# EAGLE design midi-switcher-smt-relay (EAGLE 6.6.0)
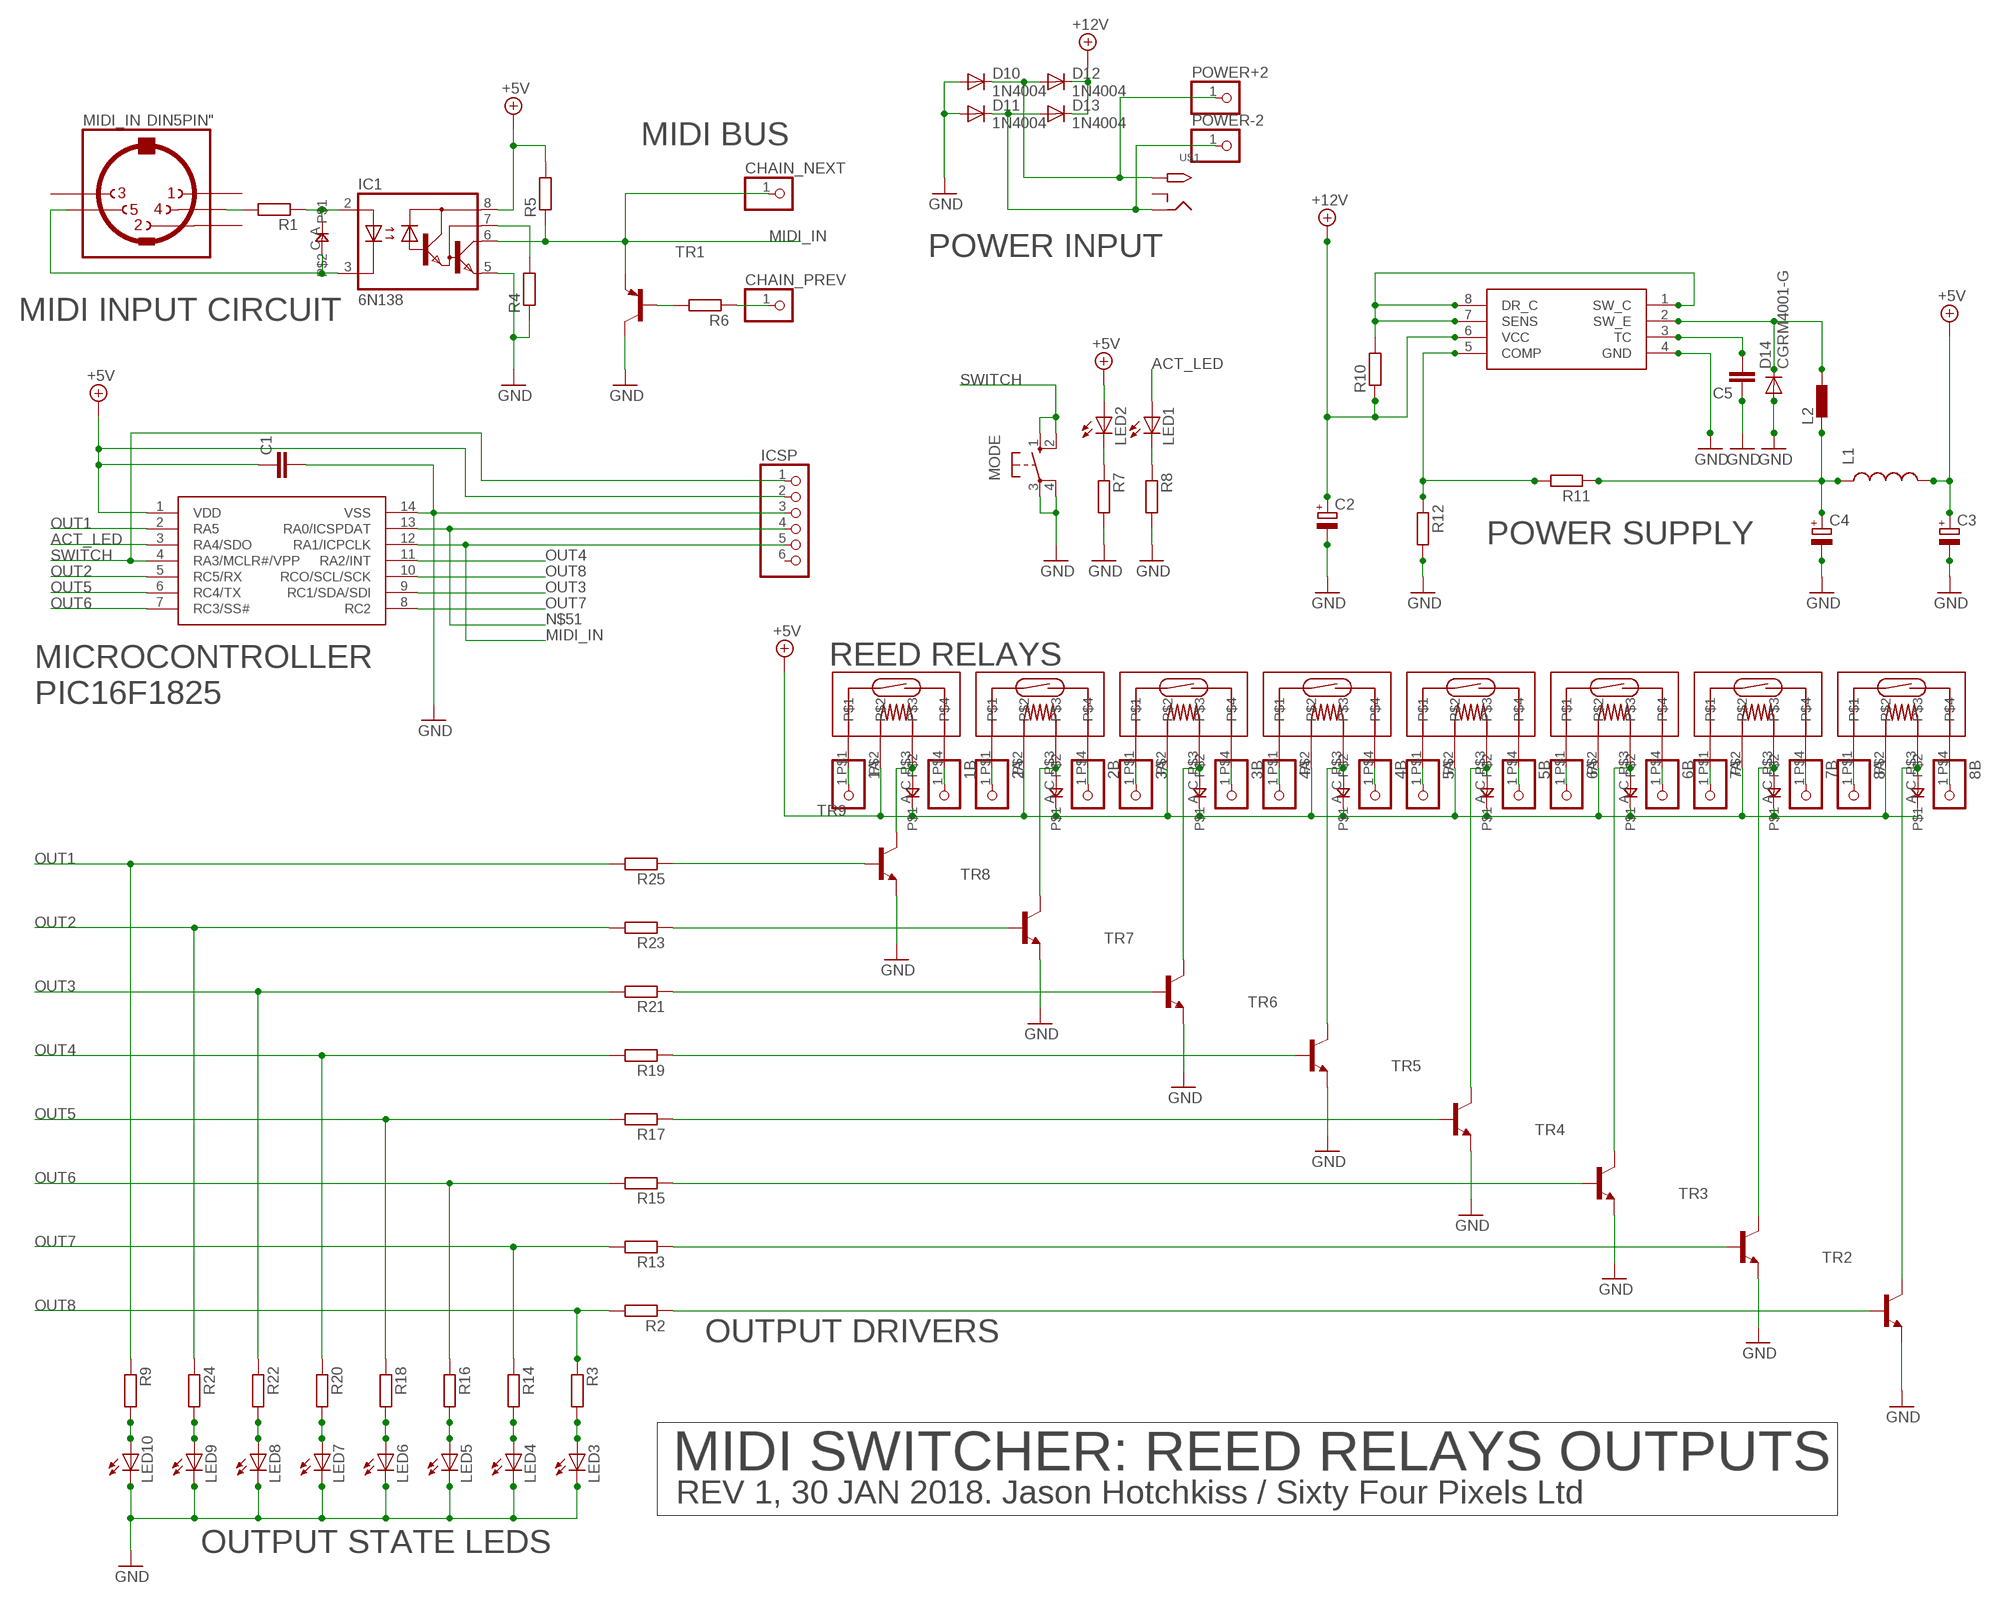
[diagram p0: schematic, sheet 1]

## Parts
1A  PINHD-1X1  [1X01]
1B  PINHD-1X1  [1X01]
2A  PINHD-1X1  [1X01]
2B  PINHD-1X1  [1X01]
3A  PINHD-1X1  [1X01]
3B  PINHD-1X1  [1X01]
4A  PINHD-1X1  [1X01]
4B  PINHD-1X1  [1X01]
5A  PINHD-1X1  [1X01]
5B  PINHD-1X1  [1X01]
6A  PINHD-1X1  [1X01]
6B  PINHD-1X1  [1X01]
7A  PINHD-1X1  [1X01]
7B  PINHD-1X1  [1X01]
8A  PINHD-1X1  [1X01]
8B  PINHD-1X1  [1X01]
C1  C-EUC0805  [C0805]
C2  CPOL-EUE2.5-7  [E2,5-7]
C3  CPOL-EUE2.5-7  [E2,5-7]
C4  CPOL-EUE2.5-7  [E2,5-7]
C5  C-EUC0805  [C0805]
CHAIN_NEXT  PINHD-1X1  [1X01]
CHAIN_PREV  PINHD-1X1  [1X01]
D1  0805DIODE  [0805DIODE]
D2  0805DIODE  [0805DIODE]
D3  0805DIODE  [0805DIODE]
D4  0805DIODE  [0805DIODE]
D5  0805DIODE  [0805DIODE]
D6  0805DIODE  [0805DIODE]
D7  0805DIODE  [0805DIODE]
D8  0805DIODE  [0805DIODE]
D9  0805DIODE  [0805DIODE]
D10  1N4004  [DO-VERT]
D11  1N4004  [DO-VERT]
D12  1N4004  [DO-VERT]
D13  1N4004  [DO-VERT]
D14  CGRM4001-G  [SOD-123_MINI-SMA]
IC1  6N138  [DIL08]
IC2  PIC16F1825SO14  [SO14]
IC3  SP34063A_BOOST_REG  [SOIC8]
ICSP  HEADER-1X6  [1X06_OVAL]
L1  INDUCTOR1210  [1210]
L2  DR1030  [DR1030]
LED1  LEDCHIP-LED0805  [CHIP-LED0805]
LED2  LEDCHIP-LED0805  [CHIP-LED0805]
LED3  LEDCHIP-LED0805  [CHIP-LED0805]
LED4  LEDCHIP-LED0805  [CHIP-LED0805]
LED5  LEDCHIP-LED0805  [CHIP-LED0805]
LED6  LEDCHIP-LED0805  [CHIP-LED0805]
LED7  LEDCHIP-LED0805  [CHIP-LED0805]
LED8  LEDCHIP-LED0805  [CHIP-LED0805]
LED9  LEDCHIP-LED0805  [CHIP-LED0805]
LED10  LEDCHIP-LED0805  [CHIP-LED0805]
MIDI_IN  DIN5PIN"  [TRUCONN90]
MODE  10-XX  [B3F-10XX]
POWER+2  PINHD-1X1  [1X01]
POWER-2  PINHD-1X1  [1X01]
R1  R-EU_R0805  [R0805]
R2  R-EU_R0805  [R0805]
R3  R-EU_R0805  [R0805]
R4  R-EU_R0805  [R0805]
R5  R-EU_R0805  [R0805]
R6  R-EU_R0805  [R0805]
R7  R-EU_R0805  [R0805]
R8  R-EU_R0805  [R0805]
R9  R-EU_R0805  [R0805]
R10  R-EU_R0805  [R0805]
R11  R-EU_R0805  [R0805]
R12  R-EU_R0805  [R0805]
R13  R-EU_R0805  [R0805]
R14  R-EU_R0805  [R0805]
R15  R-EU_R0805  [R0805]
R16  R-EU_R0805  [R0805]
R17  R-EU_R0805  [R0805]
R18  R-EU_R0805  [R0805]
R19  R-EU_R0805  [R0805]
R20  R-EU_R0805  [R0805]
R21  R-EU_R0805  [R0805]
R22  R-EU_R0805  [R0805]
R23  R-EU_R0805  [R0805]
R24  R-EU_R0805  [R0805]
R25  R-EU_R0805  [R0805]
RL1  9007-REED-RELAY  [9007-REED-RELAY]
RL2  9007-REED-RELAY  [9007-REED-RELAY]
RL3  9007-REED-RELAY  [9007-REED-RELAY]
RL4  9007-REED-RELAY  [9007-REED-RELAY]
RL5  9007-REED-RELAY  [9007-REED-RELAY]
RL6  9007-REED-RELAY  [9007-REED-RELAY]
RL7  9007-REED-RELAY  [9007-REED-RELAY]
RL8  9007-REED-RELAY  [9007-REED-RELAY]
TR1  MMBT3906LT1-PNP-SOT23-BEC  [SOT23-BEC]
TR2  MMBT3904LT1-NPN-SOT23-BEC  [SOT23-BEC]
TR3  MMBT3904LT1-NPN-SOT23-BEC  [SOT23-BEC]
TR4  MMBT3904LT1-NPN-SOT23-BEC  [SOT23-BEC]
TR5  MMBT3904LT1-NPN-SOT23-BEC  [SOT23-BEC]
TR6  MMBT3904LT1-NPN-SOT23-BEC  [SOT23-BEC]
TR7  MMBT3904LT1-NPN-SOT23-BEC  [SOT23-BEC]
TR8  MMBT3904LT1-NPN-SOT23-BEC  [SOT23-BEC]
TR9  MMBT3904LT1-NPN-SOT23-BEC  [SOT23-BEC]
U$1  2.1MMJACKTHM  [PJ-102A]

## Nets
+5V: C1.1 C3.+ D2.A D3.A D4.A D5.A D6.A D7.A D8.A D9.A IC1.8(VCC) IC2.1(VDD) ICSP.2 L1.2 LED2.A R5.2 RL1.P$2 RL2.P$2 RL3.P$2 RL4.P$2 RL5.P$2 RL6.P$2 RL7.P$2 RL8.P$2
+12V: C2.+ D12.C D13.C IC3.6(VCC) R10.1
ACT_LED: IC2.3(RA4/SDO) LED1.A
GND: C1.2 C2.- C3.- C4.- C5.1 D10.A D11.A D14.A IC1.5(GND) IC2.14(VSS) IC3.4(GND) ICSP.3 LED3.C LED4.C LED5.C LED6.C LED7.C LED8.C LED9.C LED10.C MODE.3(P) MODE.4(P1) R4.1 R7.2 R8.2 R12.2 TR1.C TR2.E TR3.E TR4.E TR5.E TR6.E TR7.E TR8.E TR9.E
MIDI_IN: CHAIN_NEXT.1 IC1.6(VO) IC2.12(RA1/ICPCLK) ICSP.5 R5.1 TR1.E
N$1: D1.C IC1.3(C) MIDI_IN.5
N$2: MIDI_IN.4 R1.2
N$3: D1.A IC1.2(A) R1.1
N$4: IC1.7(VB) R4.2
N$5: LED1.C R8.1
N$6: LED10.A R9.2
N$7: LED9.A R24.2
N$8: R25.1 TR9.B
N$9: R23.1 TR8.B
N$10: R21.1 TR7.B
N$11: R19.1 TR6.B
N$12: R17.1 TR5.B
N$13: R15.1 TR4.B
N$14: R13.1 TR3.B
N$15: R2.1 TR2.B
N$16: R6.2 TR1.B
N$17: 1A.1 RL8.P$1
N$18: CHAIN_PREV.1 R6.1
N$19: 1B.1 RL8.P$4
N$20: 2A.1 RL7.P$1
N$21: 2B.1 RL7.P$4
N$22: 3A.1 RL6.P$1
N$23: 3B.1 RL6.P$4
N$24: LED8.A R22.2
N$25: 4A.1 RL5.P$1
N$26: 4B.1 RL5.P$4
N$27: 5A.1 RL4.P$1
N$28: LED2.C R7.1
N$29: 5B.1 RL4.P$4
N$30: 6A.1 RL3.P$1
N$31: 6B.1 RL3.P$4
N$32: 7A.1 RL2.P$1
N$33: LED7.A R20.2
N$34: 7B.1 RL2.P$4
N$35: LED6.A R18.2
N$36: LED5.A R16.2
N$37: LED4.A R14.2
N$38: LED3.A R3.2
N$39: D11.C D13.A POWER-2.1 U$1.RING
N$40: 8A.1 RL1.P$1
N$41: 8B.1 RL1.P$4
N$42: C5.2 IC3.3(TC)
N$43: D10.C D12.A POWER+2.1 U$1.TIP
N$44: D9.C RL8.P$3 TR9.C
N$45: D8.C RL7.P$3 TR8.C
N$46: D7.C RL6.P$3 TR7.C
N$47: D6.C RL5.P$3 TR6.C
N$48: D5.C RL4.P$3 TR5.C
N$49: D4.C RL3.P$3 TR4.C
N$50: D3.C RL2.P$3 TR3.C
N$51: IC2.13(RA0/ICSPDAT) ICSP.4
N$52: D2.C RL1.P$3 TR2.C
N$53: D14.C IC3.2(SW_E) L2.2
N$56: C4.+ L1.1 L2.1 R11.1
N$58: IC3.5(COMP) R11.2 R12.1
N$59: IC3.1(SW_C) IC3.7(SENS) IC3.8(DR_C) R10.2
OUT1: IC2.2(RA5) R9.1 R25.2
OUT2: IC2.5(RC5/RX) R23.2 R24.1
OUT3: IC2.9(RC1/SDA/SDI) R21.2 R22.1
OUT4: IC2.11(RA2/INT) R19.2 R20.1
OUT5: IC2.6(RC4/TX) R17.2 R18.1
OUT6: IC2.7(RC3/SS#) R15.2 R16.1
OUT7: IC2.8(RC2) R13.2 R14.1
OUT8: IC2.10(RCO/SCL/SCK) R2.2 R3.1
SWITCH: IC2.4(RA3/MCLR#/VPP) ICSP.1 MODE.1(S) MODE.2(S1)
Unconnected: ICSP.6 MIDI_IN.1 MIDI_IN.2 MIDI_IN.3 U$1.RING_SW

## Notes on the sheet
- MIDI BUS
- POWER INPUT
- MIDI INPUT CIRCUIT
- POWER SUPPLY
- REED RELAYS
- MICROCONTROLLER 
  PIC16F1825
- OUTPUT DRIVERS
- MIDI SWITCHER: REED RELAYS OUTPUTS
- REV 1, 30 JAN 2018. Jason Hotchkiss / Sixty Four Pixels Ltd
- OUTPUT STATE LEDS

## Library data of the parts
1A 1B 2A 2B 3A 3B 4A 4B 5A 5B 6A 6B 7A 7B 8A 8B CHAIN_NEXT CHAIN_PREV POWER+2 POWER-2 = adafruit:PINHD-1X1: Pin header 1x1 for 0.1" spacing With round pins
C1 C5 = rcl:C-EU: CAPACITOR, European symbol
C2-C4 = resistor:CPOL-EU: POLARIZED CAPACITOR, European symbol
D1-D9 = jasons_stuff:0805DIODE
D10-D13 = jasons_stuff:1N4004: DIODE general purpose rectifier, 1 A
D14 = diode:CGRM400*-G: Molded plasitc,JEDEC SOD-123/Mini SMA Source: Comchip CGRM4001-G.pdf
IC1 = optocoupler:6N138: MOTOROLA OPTO COUPLER
IC2 = jasons_stuff:PIC16F1825
IC3 = jason_eagle6:SP34063A_BOOST_REG
ICSP = microbuilder:HEADER-1X6: PIN HEADER
L1 = SparkFun:INDUCTOR: Inductors Basic Inductor/Choke - 0603 and 1206. Footprints are not proven and vary greatly between part numbers.
L2 = inductors:DR1030: DR1030 Series Low Profile Power Inductors Source: Data sheet <http://www.cooperbussmann.com/pdf/c73e479f-f867-4c64-ae26-9c1f23814163.pdf>
LED1-LED10 = led:LED: LED OSRAM: - CHIPLED LG R971, LG N971, LY N971, LG Q971, LY Q971, LO R971, LY R971 LH N974, LH R974 LS Q976, LO Q976, LY Q976 LO Q996 - Hyper CHIPLED LW Q18S LB Q993, LB Q99A, LB R99A - SideLED LS A670, LO A670, LY A670, LG A670, LP A670 LB A673, LV A673, LT A673, LW A673 LH A674 LY A675 LS A676, LA A676, LO A676, LY A676, LW A676 LS A679, LY A679, LG A679 - Hyper Micro SIDELED® LS Y876, LA Y876, LO Y876, LY Y876 LT Y87S - SmartLED LW L88C, LW L88S LB L89C, LB L89S, LG L890 LS L89K, LO L89K, LY L89K LS L896, LA L896, LO L896, LY L896 - TOPLED LS T670, LO T670, LY T670, LG T670, LP T670 LSG T670, LSP T670, LSY T670, LOP T670, LYG T670 LG T671, LOG T671, LSG T671 LB T673, LV T673, LT T673, LW T673 LH T674 LS T676, LA T676, LO T676, LY T676, LB T676, LH T676, LSB T676, LW T676 LB T67C, LV T67C, LT T67C, LS T67K, LO T67K, LY T67K, LW E67C LS E67B, LA E67B, LO E67B, LY E67B, LB E67C, LV E67C, LT E67C LW T67C LS T679, LY T679, LG T679 LS T770, LO T770, LY T770, LG T770, LP T770 LB T773, LV T773, LT T773, LW T773 LH T774 LS E675, LA E675, LY E675, LS T675 LS T776, LA T776, LO T776, LY T776, LB T776 LHGB T686 LT T68C, LB T68C - Hyper Mini TOPLED® LB M676 - Mini TOPLED Santana® LG M470 LS M47K, LO M47K, LY M47K Source: http://www.osram.convergy.de LUXEON: - LUMILED® LXK2-PW12-R00, LXK2-PW12-S00, LXK2-PW14-U00, LXK2-PW14-V00 LXK2-PM12-R00, LXK2-PM12-S00, LXK2-PM14-U00 LXK2-PE12-Q00, LXK2-PE12-R00, LXK2-PE12-S00, LXK2-PE14-T00, LXK2-PE14-U00 LXK2-PB12-K00, LXK2-PB12-L00, LXK2-PB12-M00, LXK2-PB14-N00, LXK2-PB14-P00, LXK2-PB14-Q00 LXK2-PR12-L00, LXK2-PR12-M00, LXK2-PR14-Q00, LXK2-PR14-R00 LXK2-PD12-Q00, LXK2-PD12-R00, LXK2-PD12-S00 LXK2-PH12-R00, LXK2-PH12-S00 LXK2-PL12-P00, LXK2-PL12-Q00, LXK2-PL12-R00 Source: www.luxeon.com KINGBRIGHT: KA-3528ASYC Source: www.kingbright.com
MIDI_IN = jasons_stuff:DIN5PIN: Female CONNECTOR 5 pins 90 deg. with shield, horizontal (DIN 41524)
MODE = switch-omron:10-XX: OMRON SWITCH
R1-R25 = rcl:R-EU_: RESISTOR, European symbol
RL1-RL8 = jason_eagle6:9007-REED-RELAY
TR1 = transistor:*-PNP-: PNP Transistror
TR2-TR9 = transistor:*-NPN-: NPN Transistror BF959 corrected 2008.03.06
U$1 = adafruit:2.1MMJACK: 2.1mm x 5.5mm THM DC jack with internal switch. Digikey part #PJ-102A, 4UCON part #05537 2.1mm x 5.5mm SMT DC jack with internal switch. Digikey part #PJ-002A-SMT, 4UCON part #03267 By microbuilder.eu & adafruit.com

## Board
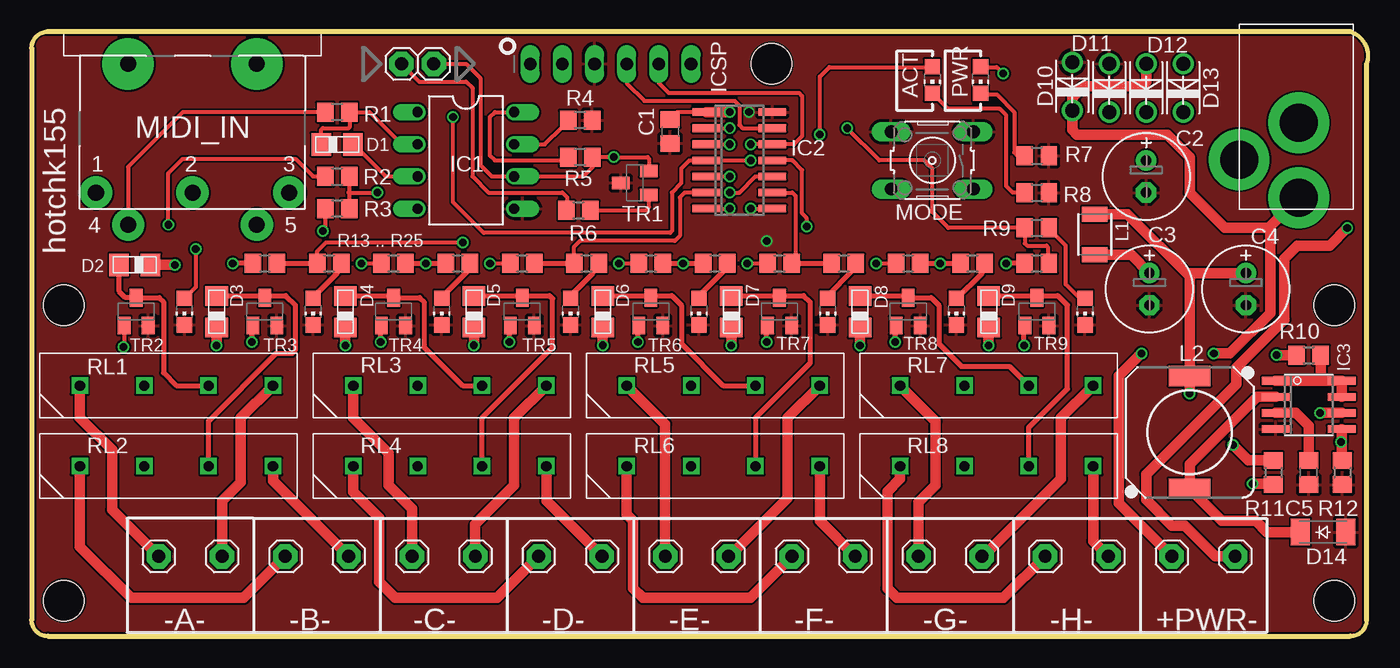
[diagram p1: board, top side]
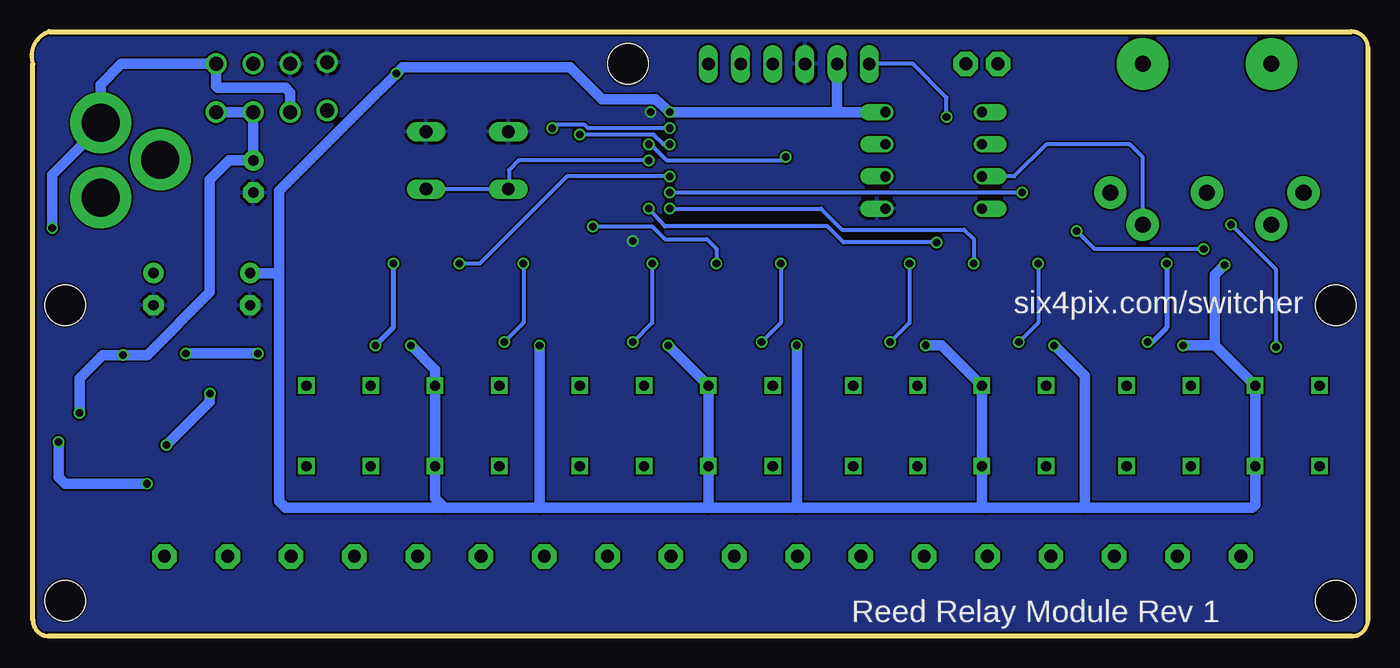
[diagram p2: board, bottom side, seen from below]

Size 105.51 x 47.72 mm. Coordinates in mm from the lower left corner, seen from the top.
Outline: 1.27,0 104.14,0 arc90 105.41,1.27 105.41,45.18 arc90 104.14,47.72 1.27,47.72 arc90 0,46.45 0,1.27 arc90 1.27,0
Copper layers (1*16): Top 0.035mm / dielectric 1.5mm / Bottom 0.035mm
Design rules "hackvana": minimum track width 6mil, minimum drill 0.3mm, track to track 6mil, track to pad 9mil, pad to pad 6mil, via to via 6mil, smd to smd 0mil, copper to edge 6mil, drill to drill 6mil, minimum pad ring 10mil, minimum via ring 6mil, stop-mask expansion 2mil, vias tented up to drill 100mil, thermal gap 10mil
Holes 3.2 mm at 2.54,2.81 102.87,2.81 58.42,45.18 2.54,26.13 102.87,26.13

### Footprints (pad centres in the part's own frame; a part is rotated, then mirrored left to right if it is on the bottom)
1X01 = drill 1.016 pad 1.93 octagon: 1 0,0
C0805 = smd 1.3 x 1.5: 1 -0.95,0; 2 0.95,0
E2,5-7 = drill 0.813 pad 1.6: + -1.27,0 | drill 0.813 pad 1.6 octagon: - 1.27,0
0805DIODE = smd 1.524 x 1.778: A -1.262,-0.005; C 1.238,-0.005
DO-VERT = drill 1.118: A 2.54,0; C -1.27,0
SOD-123_MINI-SMA = smd 1.5 x 2.1: A 1.8,0; C -1.8,0
DIL08 = drill 0.813 offset: 1 -3.81,-3.81; 2 -1.27,-3.81; 3 1.27,-3.81; 4 3.81,-3.81; 5 3.81,3.81; 6 1.27,3.81; 7 -1.27,3.81; 8 -3.81,3.81
SO14 = smd 0.6 x 2.2: 1 -3.81,-2.6; 2 -2.54,-2.6; 3 -1.27,-2.6; 4 0,-2.6; 5 1.27,-2.6; 6 2.54,-2.6; 7 3.81,-2.6; 8 3.81,2.6; 9 2.54,2.6; 10 1.27,2.6; 11 0,2.6; 12 -1.27,2.6; 13 -2.54,2.6; 14 -3.81,2.6
SOIC8 = smd 0.6 x 2.2: 1 -1.905,-2.6; 2 -0.635,-2.6; 3 0.635,-2.6; 4 1.905,-2.6; 5 1.905,2.6; 6 0.635,2.6; 7 -0.635,2.6; 8 -1.905,2.6
1X06_OVAL = drill 1 long: 1 -6.35,0; 2 -3.81,0; 3 -1.27,0; 4 1.27,0; 5 3.81,0; 6 6.35,0
1210 = smd 1.2 x 2: 1 -1.6,0; 2 1.6,0
DR1030 = smd 3.3 x 1.6: 1 0,4.45; 2 0,-4.45
CHIP-LED0805 = smd 1.2 x 1.2: A 0,-1.05; C 0,1.05
TRUCONN90 = drill 1.27 pad 2.54: 1 7.62,5.08; 2 0,5.08; 3 -7.62,5.08; 4 5.08,7.62; 5 -5.08,7.62 | drill 1.27 pad 4.064: NC -5.08,-5.08; NC@ 5.08,-5.08
B3F-10XX = drill 1.016 long: 1 -3.251,2.261; 2 3.251,2.261; 3 -3.251,-2.261; 4 3.251,-2.261
R0805 = smd 1.3 x 1.5: 1 -0.95,0; 2 0.95,0
9007-REED-RELAY = drill 0.8 square: P$1 0,7.62; P$2 0,2.54; P$3 0,-2.54; P$4 0,-7.62
SOT23-BEC = smd 1 x 1.4: B -0.95,-1.1; C 0,1.1; E 0.95,-1.1
PJ-102A = drill 3 pad 4.8: RING 0.1,-3.39; RING_SW -4.6,-6.29; TIP 0.1,-9.29

### Placement (x,y rotation side)
1A  80.03,6.3 0 top
1B  85.03,6.3 0 top
2A  70.03,6.3 0 top
2B  75.03,6.3 0 top
3A  60.03,6.3 0 top
3B  65.03,6.3 0 top
4A  50.03,6.3 0 top
4B  55.03,6.3 0 top
5A  40.03,6.3 0 top
5B  45.03,6.3 0 top
6A  30.03,6.3 0 top
6B  35.03,6.3 0 top
7A  20.03,6.3 0 top
7B  25.03,6.3 0 top
8A  10.03,6.3 0 top
8B  15.03,6.3 0 top
C1  50.42,39.85 270 top
C2  88.01,36.29 270 top
C3  88.27,27.4 270 top
C4  95.89,27.4 270 top
C5  100.84,12.92 90 top
CHAIN_NEXT  31.75,45.18 0 top
CHAIN_PREV  29.21,45.18 0 top
D1  24.13,38.83 0 top
D2  8.13,29.31 180 top
D3  14.6,25.62 90 top
D4  24.77,25.62 90 top
D5  34.93,25.62 90 top
D6  45.09,25.62 90 top
D7  55.25,25.62 90 top
D8  65.41,25.62 90 top
D9  75.56,25.62 90 top
D10  82.17,42.77 90 top
D11  85.09,42.64 90 top
D12  88.01,42.64 90 top
D13  90.93,42.64 90 top
D14  101.98,8.22 0 top
IC1  34.29,37.56 270 top
IC2  55.88,37.56 270 top
IC3  100.84,18.26 270 top
ICSP  45.72,45.18 0 top
L1  83.95,31.72 270 top
L2  91.44,16.1 0 top
LED1  71.12,43.91 180 top
LED2  74.93,43.91 180 top
LED3  12.06,25.62 180 top
LED4  22.23,25.62 180 top
LED5  32.38,25.62 180 top
LED6  42.55,25.62 180 top
LED7  52.7,25.62 180 top
LED8  62.86,25.62 180 top
LED9  73.03,25.62 180 top
LED10  83.19,25.62 180 top
MIDI_IN  12.7,40.1 180 top
MODE  71.12,37.56 180 top
POWER+2  90.03,6.3 0 top
POWER-2  95.03,6.3 0 top
R1  24.13,41.37 180 top
R2  24.13,36.29 0 top
R3  24.13,33.75 180 top
R4  43.31,40.73 180 top
R5  43.31,37.81 180 top
R6  43.18,33.62 0 top
R7  79.38,37.94 0 top
R8  79.38,35.02 0 top
R9  79.38,32.23 0 top
R10  100.84,22.19 0 top
R11  98.04,12.92 270 top
R12  103.5,12.92 270 top
R13  18.41,29.43 0 top
R14  23.5,29.43 0 top
R15  28.58,29.43 0 top
R16  33.66,29.43 0 top
R17  38.73,29.43 0 top
R18  43.81,29.43 0 top
R19  48.9,29.43 0 top
R20  53.97,29.43 0 top
R21  59.06,29.43 0 top
R22  64.14,29.43 0 top
R23  69.22,29.43 0 top
R24  74.3,29.43 0 top
R25  79.38,29.43 0 top
RL1  11.43,19.78 90 top
RL2  11.43,13.43 90 top
RL3  33.02,19.78 90 top
RL4  33.02,13.43 90 top
RL5  54.61,19.78 90 top
RL6  54.61,13.43 90 top
RL7  76.2,19.78 90 top
RL8  76.2,13.43 90 top
TR1  47.62,35.78 90 top
TR2  8.26,25.62 0 top
TR3  18.41,25.62 0 top
TR4  28.58,25.62 0 top
TR5  38.73,25.62 0 top
TR6  48.9,25.62 0 top
TR7  59.06,25.62 0 top
TR8  69.22,25.62 0 top
TR9  79.38,25.62 0 top
U$1  99.95,43.91 0 top

### Tracks (layer width: path | path; a pad name or v marks a point on that pad's centre or on a via)
+5V  (via drill 0.6)
  Top 0.305: 74.96,44.89 74.96,44.93 76.2,44.93 v76.71,44.42 | IC1.8 36.58,41.37 36.2,40.99 36.2,37.94 36.58,37.56 42.1,37.56 R5.2 | IC2.1 50.99,41.37 C1.1
  Top 0.813: D3.A v14.61,22.96 v14.6,22.96 | v11.3,29.31 D2.A | v75.56,22.96 D9.A | D8.A v65.41,22.96 | D6.A v45.09,22.96 | D5.A v34.93,22.96 | D4.A v24.77,22.96 | 74.96,44.93 LED2.A | IC2.1 v55.12,41.37 | L1.2 86.82,30.12 C3.+ | D7.A v55.25,22.96
  Bottom 0.305: 40.64,41.37 IC1.8
  Bottom 0.813: 22.48,10.13 9.14,10.13 8.89,10.38 RL2.P$2 RL1.P$2 12.06,22.96 | 22.48,10.13 30.23,10.13 | 30.23,10.13 45.09,10.13 | 45.09,10.13 52.07,10.13 | 52.07,10.13 65.41,10.13 | 65.41,10.13 72.9,10.13 | 72.9,10.13 73.66,10.89 RL8.P$2 RL7.P$2 73.66,21.05 v75.56,22.96 | 30.23,10.13 30.48,10.38 RL4.P$2 RL3.P$2 33.66,22.96 v34.93,22.96 | 52.07,10.13 RL6.P$2 RL5.P$2 v55.25,22.96 | v14.6,22.96 12.06,22.96 | 12.06,22.96 12.06,28.54 v11.3,29.31 | 65.41,10.13 v65.41,22.96 | v45.09,22.96 45.09,10.13 | 22.48,10.13 22.35,10.25 22.35,20.54 v24.77,22.96 | 72.9,10.13 85.47,10.13 85.98,10.64 85.98,28.42 | 85.98,28.42 85.98,35.15 79.25,41.88 v76.71,44.42 76.2,44.93 62.99,44.93 60.45,42.39 56.26,42.39 v55.12,41.37 41.91,41.37 | C3.+ 86.23,28.67 85.98,28.42 | 41.91,41.37 IC1.8 | ICSP.2 41.91,41.37
+12V  (via drill 0.6)
  Top 0.813: IC3.6 v101.73,17.62 | v98.3,22.19 R10.1 100.02,22.32
  Bottom 0.813: D13.C D12.C C2.+ 89.92,37.56 91.44,36.04 91.44,27.15 96.39,22.19 v98.3,22.19 R10.1 101.73,20.35 v101.73,17.62
ACT_LED  (via drill 0.6)
  Top 0.305: LED1.A 71.09,44.93 62.99,44.93 62.23,44.16 v62.23,39.59 | IC2.3 v55.12,38.83
  Bottom 0.305: v55.12,38.83 55.63,38.83 56.39,39.59 v62.23,39.59
GND  (via drill 0.6)
  other vias: 56.64,41.37 58.04,31.21
  pour Top: -6.35,51.53 -6.35,-1 109.22,-1 109.22,51.53
  pour Bottom: -6.35,51.53 -6.35,-1.81 107.95,-1.81 109.22,51.53
MIDI_IN  (via drill 0.6)
  Top 0.305: CHAIN_NEXT.1 34.29,45.18 35.43,44.04 35.43,37.18 36.32,36.29 IC1.6 43.56,36.29 44.32,37.05 44.32,37.75 R5.1 v45.97,37.81 48.64,37.81 48.77,37.69 48.77,36.78 TR1.E | v56.77,38.83 IC2.12 60.2,38.83 60.83,39.47 60.83,42.64 60.58,42.89 50.29,42.89 49.53,43.66 ICSP.5
  Bottom 0.305: v56.77,38.83 56.64,38.83 55.37,37.56 46.23,37.56 v45.97,37.81
N$1
  Top 0.305: D1.C 25.41,38.83 27.94,36.29 IC1.3
  Bottom 0.305: MIDI_IN.5 17.78,37.81 18.8,38.83 25.4,38.83 27.94,36.29 IC1.3
N$2
  Top 0.305: R1.2 11.94,41.37 7.62,37.05 MIDI_IN.4
N$3
  Top 0.305: R1.1 25.08,41.04 | R1.1 26.67,41.37 29.21,38.83 IC1.2 | D1.A 22.87,39.98 22.99,40.1 25.02,40.1 25.15,40.23 25.15,41.3 R1.1
N$4
  Top 0.305: IC1.7 40.51,38.83 41.91,40.23 41.91,40.29 R4.2
N$5
  Top 0.305: R8.1 77.47,35.02 76.96,35.53 76.96,41.12 76.45,41.62 72.36,41.62 LED1.C
N$6
  Top 0.305: LED10.A 82.77,26.67 81.66,27.78 81.66,30.83 80.01,32.48 80.07,32.48 R9.2
N$7
  Top 0.406: LED9.A 73.06,26.67 75.06,28.67 75.06,29.24 R24.2
N$8  (via drill 0.6)
  Top 0.406: R25.1 v76.96,29.43 | v78.36,22.96 78.36,24.46 TR9.B
  Bottom 0.406: v76.96,29.43 76.96,24.35 v78.36,22.96
N$9  (via drill 0.6)
  Top 0.305: v66.67,29.43 R23.1
  Top 0.406: v68.2,23.21 68.2,24.46 TR8.B | 68.2,29.5 R23.1
  Bottom 0.305: v66.67,29.43 66.67,24.73 v68.2,23.21
N$10  (via drill 0.6)
  Top 0.305: v56.52,29.43 R21.1
  Top 0.406: v58.04,23.21 58.04,24.46 TR7.B | 58.04,29.5 R21.1
  Bottom 0.305: v56.52,29.43 56.52,24.73 v58.04,23.21
N$11  (via drill 0.6)
  Top 0.305: v46.36,29.43 R19.1
  Top 0.406: v47.88,23.21 47.88,24.46 TR6.B | 47.88,29.5 R19.1
  Bottom 0.305: v46.36,29.43 46.36,24.73 v47.88,23.21
N$12  (via drill 0.6)
  Top 0.305: v36.2,29.43 R17.1
  Top 0.406: v37.72,23.21 37.72,24.46 TR5.B | 37.72,29.5 R17.1
  Bottom 0.305: v36.2,29.43 36.2,24.73 v37.72,23.21
N$13  (via drill 0.6)
  Top 0.305: v26.04,29.43 R15.1
  Top 0.406: v27.56,23.21 27.56,24.46 TR4.B | 27.56,29.5 R15.1
  Bottom 0.305: v26.04,29.43 26.04,24.73 v27.56,23.21
N$14  (via drill 0.6)
  Top 0.406: 17.46,24.67 TR3.B 17.4,24.46 v17.4,23.21 | R13.1 v15.87,29.43
  Bottom 0.406: v15.87,29.43 15.87,24.35 17.02,23.21 v17.4,23.21
N$15  (via drill 0.6)
  Top 0.305: TR2.B 7.3,22.89 v7.24,22.83 | v10.79,32.48 10.79,36.54 11.94,37.69 20.83,37.69 22.23,36.29 R2.1
  Bottom 0.305: v7.24,22.83 7.24,28.92 v10.79,32.48
N$16
  Top 0.305: R6.2 48.51,33.62 48.77,33.88 48.77,34.79 TR1.B
N$17
  Top 0.813: RL8.P$1 68.58,12.41 67.56,11.4 67.56,3.78 68.33,3.02 76.75,3.02 1A.1
N$18
  Top 0.305: CHAIN_PREV.1 30.61,43.78 34.29,43.78 34.8,43.28 34.8,36.29 36.07,35.02 41.91,35.02 42.29,34.64 42.29,33.68 R6.1
N$19
  Top 0.813: RL8.P$4 83.82,7.51 1B.1
N$20
  Top 0.813: 2A.1 70.03,10.56 71.37,11.91 71.37,16.99 RL7.P$1
N$21
  Top 0.813: 2B.1 75.17,6.3 81.28,12.41 81.28,17.24 RL7.P$4
N$22
  Top 0.813: RL6.P$1 46.99,9.62 47.5,9.11 47.5,3.78 48.26,3.02 56.75,3.02 3A.1
N$23
  Top 0.813: RL6.P$4 62.23,9.1 3B.1
N$24
  Top 0.406: LED8.A 62.86,26.89 64.77,28.8 64.77,29.12 R22.2
N$25
  Top 0.813: RL5.P$1 50.03,16.74 4A.1
N$26
  Top 0.813: 4B.1 55.1,6.3 59.69,10.89 59.69,17.24 RL5.P$4
N$27
  Top 0.813: RL4.P$1 25.4,11.4 27.43,9.37 27.43,4.29 28.7,3.02 36.75,3.02 5A.1
N$28
  Top 0.305: LED2.C 75.02,42.77 76.2,42.77 77.6,41.37 77.6,38.2 77.85,37.94 R7.1
N$29
  Top 0.813: RL4.P$4 40.64,10.69 5B.1
N$30
  Top 0.813: RL3.P$1 25.4,17.24 28.19,14.45 28.19,11.91 30.03,10.07 6A.1
N$31
  Top 0.813: 6B.1 35.03,8.84 38.1,11.91 38.1,17.24 RL3.P$4
N$32
  Top 0.813: RL2.P$1 3.81,7.08 7.87,3.02 16.75,3.02 7A.1
N$33
  Top 0.406: LED7.A 52.7,26.89 54.74,28.92 54.74,29.24 R20.2
N$34
  Top 0.813: RL2.P$4 19.05,12.28 7B.1
N$35
  Top 0.406: LED6.A 42.55,26.89 44.32,28.67 44.32,28.99 R18.2
N$36
  Top 0.406: LED5.A 32.38,26.77 34.42,28.8 34.42,29.24 R16.2
N$37
  Top 0.406: LED4.A 22.23,26.77 24.13,28.67 24.13,29.12 R14.2
N$38  (via drill 0.6)
  Top 0.305: R3.2 23.18,32.17 v22.99,31.97 | v12.95,30.57 12.95,27.56 LED3.A
  Bottom 0.305: v22.99,31.97 21.59,30.57 v12.95,30.57
N$39  (via drill 0.6)
  Top 0.813: v103.89,32.23 102.49,30.83 99.95,30.83 98.93,29.81 98.93,24.99 95.12,21.18 95.12,19.91 88.01,12.8 88.01,10.76 90.04,8.73 91.06,8.73 93.47,6.32 95.01,6.32 POWER-2.1
  Bottom 0.813: D11.C 85.09,42.89 85.47,43.28 90.81,43.28 90.93,43.4 D13.A 98.42,45.18 100.08,43.53 100.08,40.55 U$1.RING 100.05,40.25 103.89,36.42 v103.89,32.23
N$40
  Top 0.813: RL1.P$1 3.81,17.24 6.35,14.7 6.35,9.98 8A.1
N$41
  Top 0.813: 8B.1 15.03,10.68 16.51,12.16 16.51,17.24 RL1.P$4
N$42
  Top 0.813: C5.2 100.84,16.61 99.82,17.62 IC3.3
N$43  (via drill 0.6)
  Top 0.813: U$1.TIP 97.79,32.36 97.79,32.23 | D12.A 88.01,43.78 87.63,43.4 83.06,43.4 82.17,42.51 D10.C 82.17,39.97 82.55,39.59 89.66,39.59 91.44,37.81 91.44,35.02 94.23,32.23 97.79,32.23 | POWER+2.1 90.03,6.33 85.85,10.51 85.85,20.54 v87.63,22.32 87.12,21.81 | 97.79,32.23 97.79,25.5 94.61,22.32 v93.34,22.32
  Bottom 0.813: v87.63,22.32 v93.34,22.32
N$44
  Top 0.406: D9.C 79.24,26.86 TR9.C 79.38,26.77 79.5,26.89 81.03,26.89 81.79,26.13 81.79,19.53 78.74,16.48 RL8.P$3
N$45
  Top 0.406: D8.C 69.08,26.86 TR8.C 71.04,26.72 71.63,26.13 71.63,23.08 73.41,21.3 77.22,21.3 RL7.P$3
N$46
  Top 0.406: D7.C 58.92,26.86 TR7.C 59.06,26.77 58.93,26.89 60.96,26.89 61.47,26.38 61.47,21.56 57.15,17.24 RL6.P$3
N$47
  Top 0.406: D6.C 48.76,26.86 TR6.C 48.9,26.77 48.77,26.89 50.55,26.89 51.31,26.13 51.31,23.08 54.61,19.78 RL5.P$3
N$48
  Top 0.406: D5.C 38.6,26.86 TR5.C 38.73,26.77 38.61,26.89 40.89,26.89 41.15,26.64 41.15,22.83 35.56,17.24 RL4.P$3
N$49
  Top 0.406: D4.C 28.44,26.86 TR4.C 30.65,26.72 30.99,26.38 30.99,22.83 34.04,19.78 RL3.P$3
N$50
  Top 0.406: D3.C 18.28,26.86 TR3.C 18.41,26.77 18.54,26.89 20.07,26.89 20.83,26.13 20.83,22.57 20.57,22.32 19.3,22.32 13.97,16.99 RL2.P$3
N$51
  Top 0.305: ICSP.4 46.99,43.66 48.39,42.26 55.5,42.26 55.88,41.88 55.88,40.35 56.13,40.1 IC2.13
N$52
  Top 0.406: RL1.P$3 11.43,19.78 10.41,20.8 10.41,26.38 10.08,26.72 TR2.C 8.21,26.77 7.37,26.77 6.89,27.24 D2.C
N$53
  Top 0.813: IC3.2 96.77,18.89 91.44,13.56 L2.2 93.97,9.11 96.65,9.11 97.54,8.22 D14.C
N$56  (via drill 0.6)
  Top 0.813: 91.44,28.42 L2.1 v91.44,19.14 | 91.44,28.42 91.44,28.67 C4.+ | R11.1 96.08,13.87 v94.87,15.08 | L1.1 86.54,33.32 91.44,28.42
  Bottom 0.813: v91.44,19.14 91.44,18.51 v94.87,15.08
N$58  (via drill 0.6)
  Top 0.813: IC3.5 103.44,15.28 | R12.1 103.44,13.94 103.44,15.28 | 103.44,15.28 v103.38,15.34 | v96.39,12.03 97.98,12.03 R11.2
  Bottom 0.813: v103.38,15.34 103.38,12.54 102.87,12.03 v96.39,12.03
N$59
  Top 0.813: IC3.1 101.85,20.16 | 101.85,20.16 IC3.8 IC3.7 | R10.2 101.79,20.23 101.85,20.16
OUT1  (via drill 0.6)
  Top 0.305: R25.2 80.26,29.49 80.26,30.7 80.14,30.83 78.61,30.83 78.42,31.02 R9.1 72.39,32.23 71.12,33.5 71.12,36.92 70.48,37.56 66.93,37.56 v64.39,40.1 | IC2.2 v55.12,40.1
  Bottom 0.305: v55.12,40.1 61.59,40.1 61.85,40.35 64.14,40.35 v64.39,40.1
OUT2  (via drill 0.6)
  Top 0.305: IC2.5 v55.12,36.29
  Top 0.406: R23.2 v71.75,29.43 R24.1
  Bottom 0.305: v55.12,36.29 63.25,36.29 70.1,29.43 v71.75,29.43
OUT3
  Top 0.305: IC2.9 60.07,35.02 60.33,34.77 60.33,29.75 R21.2
  Top 0.406: R21.2 R22.1
OUT4  (via drill 0.6)
  Top 0.305: v61.21,32.35 61.21,32.99 60.83,33.37 60.83,36.8 60.07,37.56 IC2.11
  Top 0.406: R19.2 v51.44,29.43 R20.1
  Bottom 0.305: v51.44,29.43 51.44,30.57 52.2,31.34 55.5,31.34 56.52,32.35 v61.21,32.35
OUT5
  Top 0.305: IC2.6 51.56,35.02 51.18,34.64 51.18,31.59 50.8,31.21 43.31,31.21 42.8,30.7 42.8,29.5 R18.1
  Top 0.406: R17.2 R18.1
OUT6  (via drill 0.6)
  Top 0.305: IC2.7 v55.12,33.75
  Top 0.406: R15.2 v31.12,29.43 R16.1
  Bottom 0.305: v55.12,33.75 43.18,33.75 41.53,32.1 31.88,32.1 31.12,31.34 v31.12,29.43
OUT7  (via drill 0.6)
  Top 0.305: R14.1 22.55,30.39 23.24,31.08 v34.04,31.08 | v56.77,33.75 IC2.8
  Top 0.406: R13.2 R14.1
  Bottom 0.305: v34.04,31.08 41.4,31.08 42.67,32.35 55.5,32.35 v56.77,33.75
OUT8  (via drill 0.6)
  Top 0.305: R3.1 R2.2 25.08,35.08 25.02,35.02 v27.3,35.02 | v55.12,35.02 55.88,35.02 57.15,36.29 IC2.10
  Bottom 0.305: v27.3,35.02 v55.12,35.02
SWITCH  (via drill 0.6)
  Top 0.305: v56.77,37.56 54.48,37.56 IC2.4 51.94,37.56 51.31,36.92 51.31,35.78 50.55,35.02 50.55,31.97 50.42,31.85 35.69,31.85 33.27,34.26 v33.27,40.99
  Bottom 0.305: v56.77,37.56 67.06,37.56 67.82,36.8 67.82,35.35 MODE.2 MODE.1 | v33.27,40.99 33.27,42.51 35.94,45.18 ICSP.1

### Text on the board
tPlace: hotchk155
bPlace: six4pix.com/switcher | Reed Relay Module Rev 1
tNames: ICSP | ACT | PWR | MODE | R13 .. R25 | -A- | -B- | -C- | -D- | -E- | -F- | -G- | -H- | +PWR-